# EAGLE design FARIOTSsch (EAGLE 9.6.2)
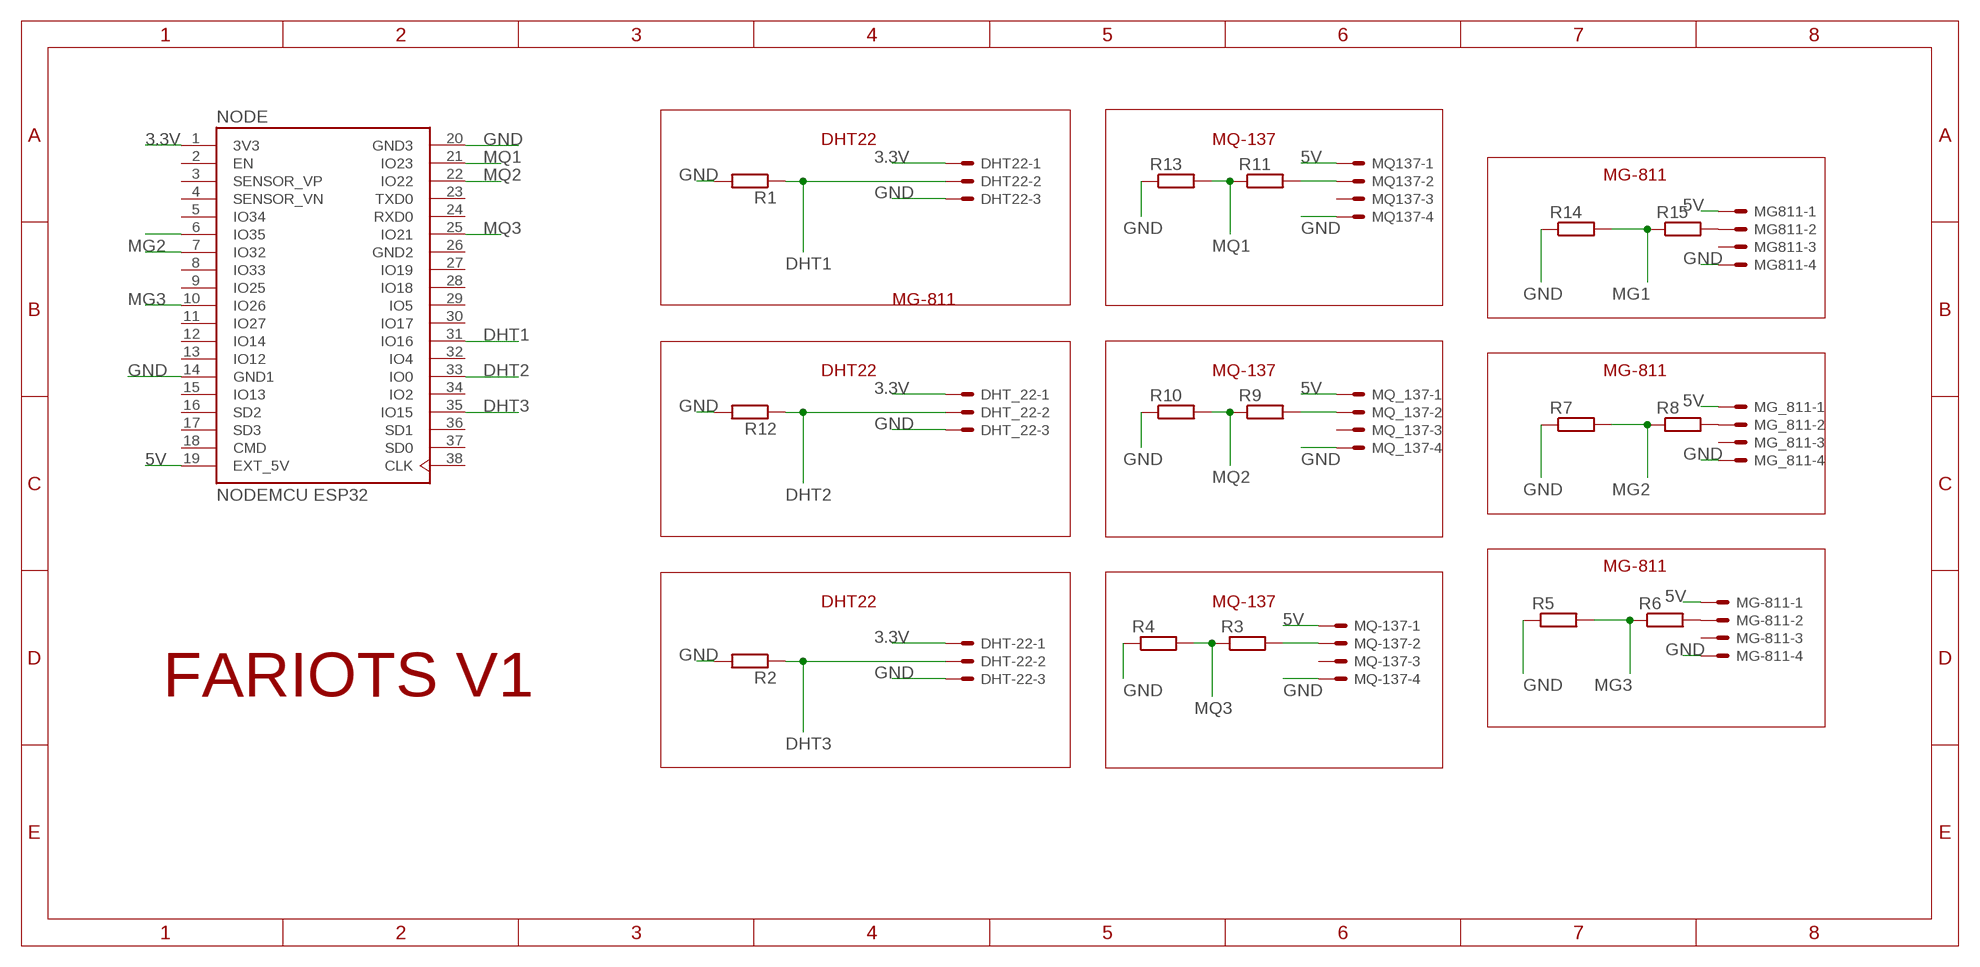
[diagram p0: schematic, sheet 1]

## Parts
DHT22  C-GRID-03-70543  [70543-03]
DHT-22  C-GRID-03-70543  [70543-03]
DHT_22  C-GRID-03-70543  [70543-03]
MG811  C-GRID-04-70543  [70543-04]
MG-811  C-GRID-04-70543  [70543-04]
MG_811  C-GRID-04-70543  [70543-04]
MQ137  C-GRID-04-70543  [70543-04]
MQ-137  C-GRID-04-70543  [70543-04]
MQ_137  C-GRID-04-70543  [70543-04]
NODE  NODEMCU ESP32  ESP32-DEVKITC-32D  [MODULE_ESP32-DEVKITC-32D]
R1  R-EU_0204/7  [0204/7]
R2  R-EU_0204/7  [0204/7]
R3  R-EU_0204/7  [0204/7]
R4  R-EU_0204/7  [0204/7]
R5  R-EU_0204/7  [0204/7]
R6  R-EU_0204/7  [0204/7]
R7  R-EU_0204/7  [0204/7]
R8  R-EU_0204/7  [0204/7]
R9  R-EU_0204/7  [0204/7]
R10  R-EU_0204/7  [0204/7]
R11  R-EU_0204/7  [0204/7]
R12  R-EU_0204/7  [0204/7]
R13  R-EU_0204/7  [0204/7]
R14  R-EU_0204/7  [0204/7]
R15  R-EU_0204/7  [0204/7]

## Nets
3.3V: DHT22.1 DHT-22.1 DHT_22.1 NODE.1(3V3)
5V: MG811.1 MG-811.1 MG_811.1 MQ137.1 MQ-137.1 MQ_137.1 NODE.19(EXT_5V)
DHT1: DHT22.2 NODE.31(IO16) R1.1
DHT2: DHT_22.2 NODE.33(IO0) R12.1
DHT3: DHT-22.2 NODE.35(IO15) R2.1
GND: DHT22.3 DHT-22.3 DHT_22.3 MG811.4 MG-811.4 MG_811.4 MQ137.4 MQ-137.4 MQ_137.4 NODE.14(GND1) NODE.20(GND3) R1.2 R2.2 R4.1 R5.1 R7.1 R10.1 R12.2 R13.1 R14.1
MG1: NODE.6(IO35) R14.2 R15.1
MG2: NODE.7(IO32) R7.2 R8.1
MG3: NODE.10(IO26) R5.2 R6.1
MQ1: NODE.21(IO23) R11.1 R13.2
MQ2: NODE.22(IO22) R9.1 R10.2
MQ3: NODE.25(IO21) R3.1 R4.2
N$1: MG-811.2 R6.2
N$2: MQ-137.2 R3.2
N$3: MG_811.2 R8.2
N$4: MQ_137.2 R9.2
N$5: MQ137.2 R11.2
N$6: MG811.2 R15.2
Unconnected: MG811.3 MG-811.3 MG_811.3 MQ137.3 MQ-137.3 MQ_137.3 NODE.2(EN) NODE.3(SENSOR_VP) NODE.4(SENSOR_VN) NODE.5(IO34) NODE.8(IO33) NODE.9(IO25) NODE.11(IO27) NODE.12(IO14) NODE.13(IO12) NODE.15(IO13) NODE.16(SD2) NODE.17(SD3) NODE.18(CMD) NODE.23(TXD0) NODE.24(RXD0) NODE.27(IO19) NODE.28(IO18) NODE.29(IO5) NODE.30(IO17) NODE.32(IO4) NODE.34(IO2) NODE.36(SD1) NODE.37(SD0) NODE.38(CLK)

## Notes on the sheet
- DHT22 | MQ-137
- MG-811
- MG-811
- DHT22 | MQ-137 | MG-811
- MG-811
- DHT22 | MQ-137
- FARIOTS V1

## Power pins joined to a net without a drawn wire
GND2: NODE.26(GND2)

## Library data of the parts
DHT22 DHT-22 DHT_22 = con-molex:C-GRID-03: CONNECTOR wire to board 2.54 mm (0.100") pitch header; MF: MOLEX; OC_FARNELL: unknown; OC_NEWARK: unknown
MG811 MG-811 MG_811 MQ137 MQ-137 MQ_137 = con-molex:C-GRID-04: CONNECTOR wire to board 2.54 mm (0.100") pitch header; MF: MOLEX; OC_FARNELL: unknown; OC_NEWARK: unknown
NODE = ESP32-DEVKITC-32D:ESP32-DEVKITC-32D: Eval Board For Esp-Wroom-32 Check availability <https://pricing.snapeda.com/parts/ESP32-DEVKITC-32D/Espressif%20Systems/view-part?ref=eda>; AVAILABILITY: In Stock; DESCRIPTION: WiFi Development Tools (802.11) ESP32 General Development Kit, ESP32-WROOM-32D on the board; MF: Espressif Systems; MP: ESP32-DEVKITC-32D; PACKAGE: None; PRICE: None; PURCHASE-URL: https://pricing.snapeda.com/search/part/ESP32-DEVKITC-32D/?ref=eda
R1-R15 = rcl:R-EU_: RESISTOR, European symbol; SPICEPREFIX: R

## Board
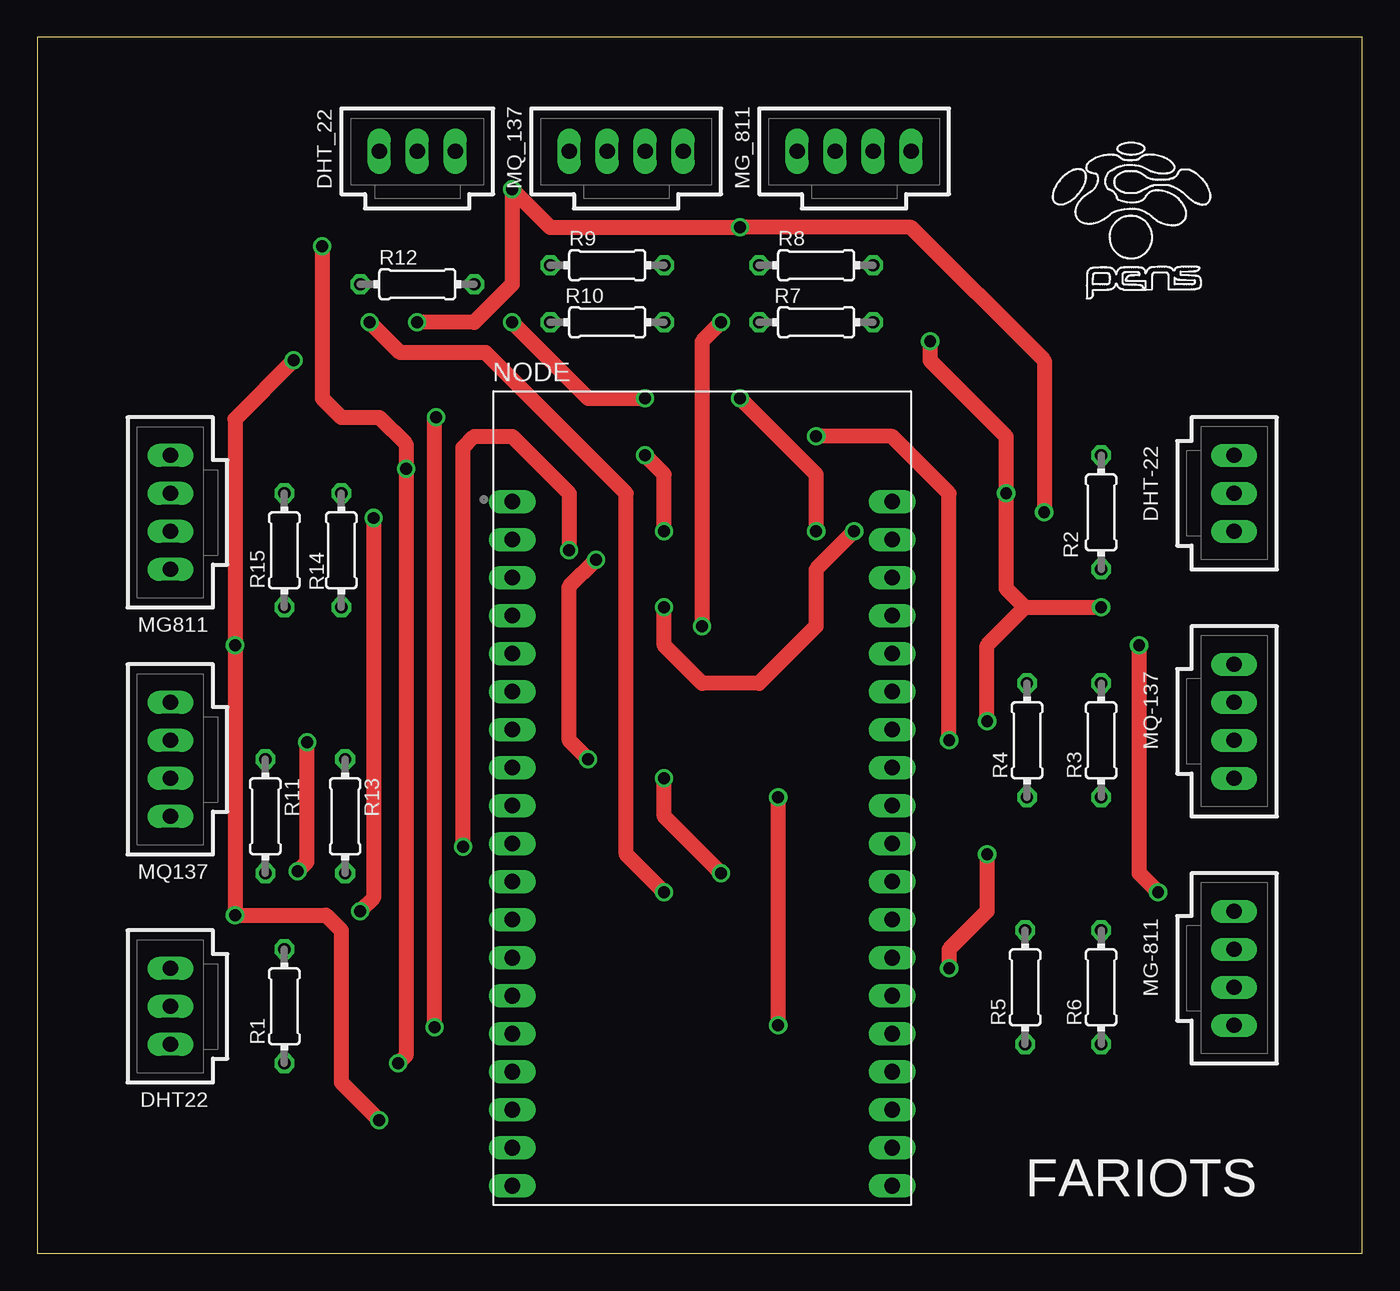
[diagram p1: board, top side]
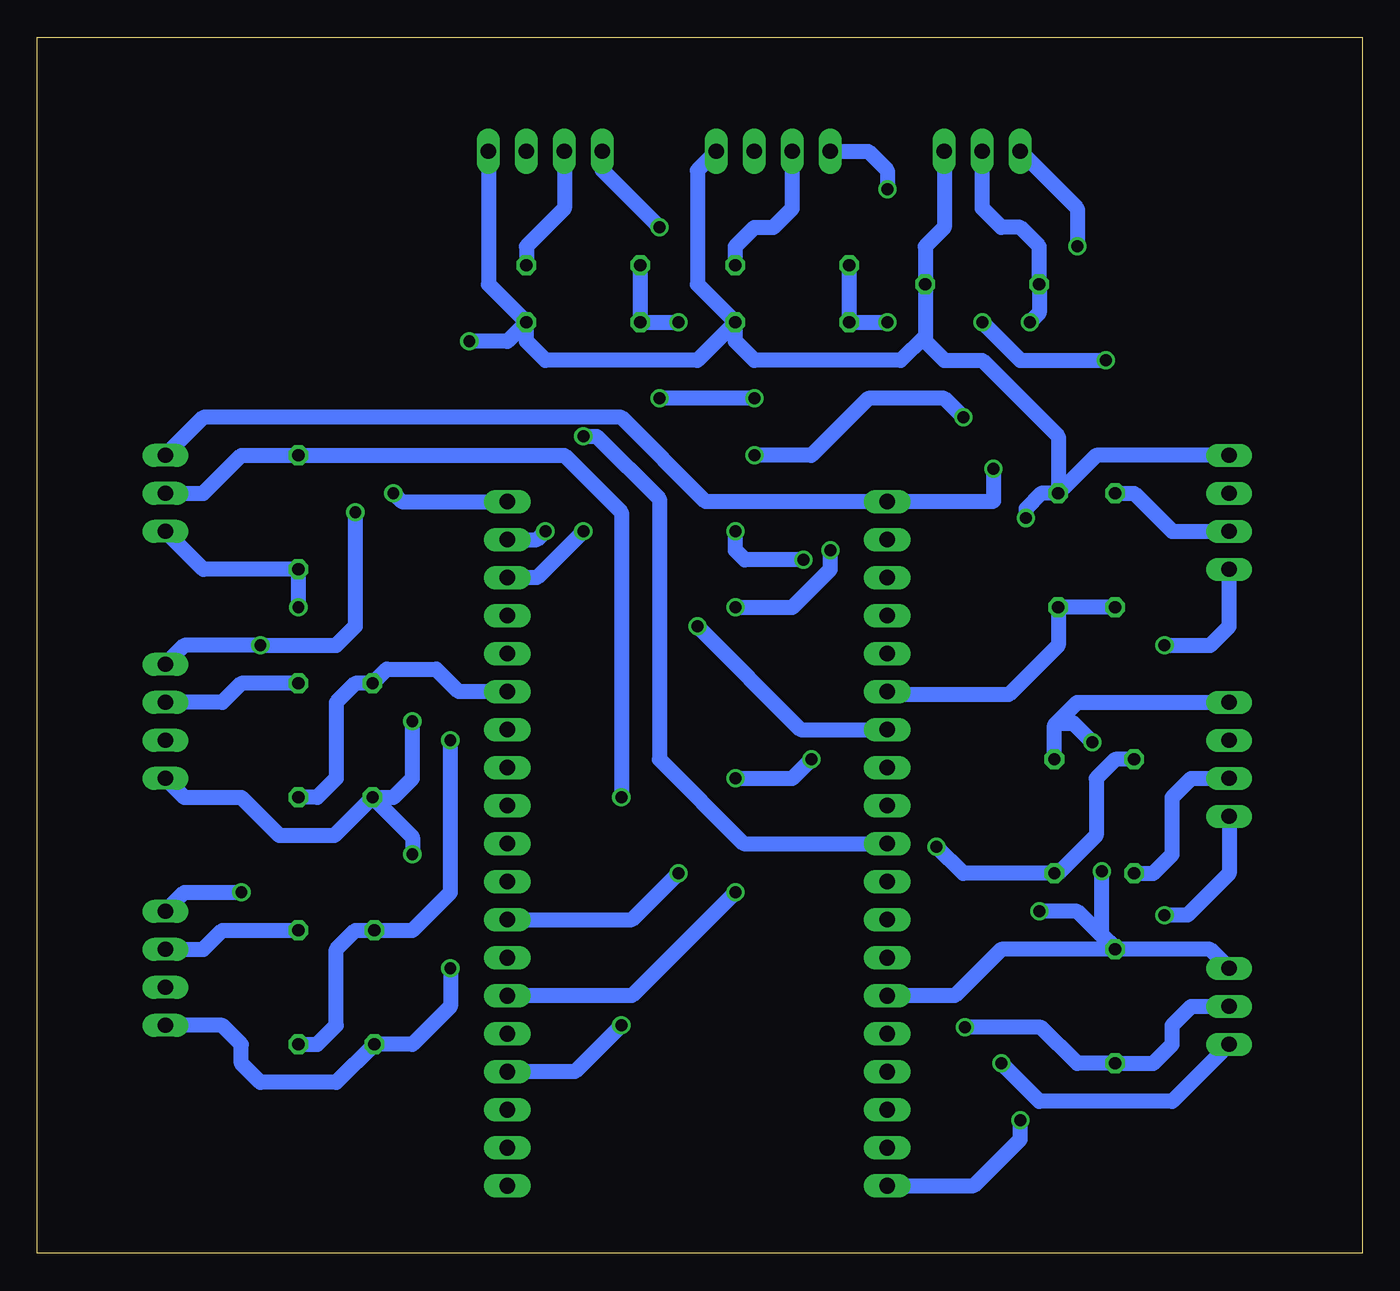
[diagram p2: board, bottom side, seen from below]

Size 88.57 x 81.27 mm. Coordinates in mm from the lower left corner, seen from the top.
Outline: 0,0 88.57,0 88.57,81.27 0,81.27 0,0
Copper layers (1*16): Top 0.035mm / dielectric 1.5mm / Bottom 0.035mm
Design rules "default *": minimum track width 6mil, minimum drill 0.35mm, track to track 6mil, track to pad 20mil, pad to pad 20mil, via to via 20mil, smd to smd 20mil, copper to edge 40mil, drill to drill 6mil, minimum pad ring 10mil, minimum via ring 8mil, stop-mask expansion 4mil, vias tented up to drill 0mil, thermal gap 10mil

### Footprints (pad centres in the part's own frame; a part is rotated, then mirrored left to right if it is on the bottom)
70543-03 = drill 1.016 long: 1 -2.54,0; 2 0,0; 3 2.54,0
70543-04 = drill 1.016 long: 1 -3.81,0; 2 -1.27,0; 3 1.27,0; 4 3.81,0
MODULE_ESP32-DEVKITC-32D = drill 1.04 long: 1 -12.7,19.76; 2 -12.7,17.22; 3 -12.7,14.68; 4 -12.7,12.14; 5 -12.7,9.6; 6 -12.7,7.06; 7 -12.7,4.52; 8 -12.7,1.98; 9 -12.7,-0.56; 10 -12.7,-3.1; 11 -12.7,-5.64; 12 -12.7,-8.18; 13 -12.7,-10.72; 14 -12.7,-13.26; 15 -12.7,-15.8; 16 -12.7,-18.34; 17 -12.7,-20.88; 18 -12.7,-23.42; 19 -12.7,-25.96; 20 12.7,19.76; 21 12.7,17.22; 22 12.7,14.68; 23 12.7,12.14; 24 12.7,9.6; 25 12.7,7.06; 26 12.7,4.52; 27 12.7,1.98; 28 12.7,-0.56; 29 12.7,-3.1; 30 12.7,-5.64; 31 12.7,-8.18; 32 12.7,-10.72; 33 12.7,-13.26; 34 12.7,-15.8; 35 12.7,-18.34; 36 12.7,-20.88; 37 12.7,-23.42; 38 12.7,-25.96
0204/7 = drill 0.813 octagon: 1 -3.81,0; 2 3.81,0

### Placement (x,y rotation side)
DHT22  8.89,16.51 90 top
DHT-22  80.01,50.8 270 top
DHT_22  25.4,73.66 0 top
MG811  8.89,49.53 90 top
MG-811  80.01,19.05 270 top
MG_811  54.61,73.66 0 top
MQ137  8.89,33.02 90 top
MQ-137  80.01,35.56 270 top
MQ_137  39.37,73.66 0 top
NODE  44.45,30.48 0 top
R1  16.51,16.51 90 top
R2  71.12,49.53 270 top
R3  71.12,34.29 90 top
R4  66.17,34.29 90 top
R5  66.04,17.78 90 top
R6  71.12,17.78 90 top
R7  52.07,62.23 180 top
R8  52.07,66.04 0 top
R9  38.1,66.04 0 top
R10  38.1,62.23 180 top
R11  15.24,29.21 270 top
R12  25.4,64.77 0 top
R13  20.57,29.21 270 top
R14  20.32,46.99 270 top
R15  16.51,46.99 90 top

### Tracks (layer width: path | path; a pad name or v marks a point on that pad's centre or on a via)
3.3V  (via drill 0.8)
  Top 1.016: v19.05,67.31 19.05,57.15 20.32,55.88 22.86,55.88 24.64,54.1 v24.64,52.45 24.64,13.21 v24.13,12.7
  Bottom 1.016: DHT22.1 12.7,10.16 21.59,10.16 v24.13,12.7 | v19.05,67.31 19.05,69.85 DHT_22.1 | DHT-22.1 77.47,55.88 49.53,55.88 43.89,50.24 NODE.1 24.69,50.24 24.64,50.29 v24.64,52.45
5V  (via drill 0.8)
  Top 1.016: v74.93,24.13 73.66,25.4 v73.66,40.64 | v22.86,8.89 20.32,11.43 20.32,21.59 19.3,22.61 v13.21,22.61 v13.21,40.64 13.21,55.75 v17.14,59.69 | v67.31,49.53 67.31,59.69 58.42,68.58 v46.99,68.58 34.29,68.58 v31.75,71.12 31.75,64.77 29.21,62.23 v25.4,62.23
  Bottom 1.016: MQ137.1 8.89,25.4 11.68,22.61 v13.21,22.61 | MG811.1 8.89,41.91 10.16,40.64 v13.21,40.64 | MQ_137.1 33.02,73.66 31.75,72.39 v31.75,71.12 | v46.99,68.58 50.8,72.39 MG_811.1 | MG-811.1 78.74,24.13 v74.93,24.13 | MQ-137.1 78.74,40.64 v73.66,40.64 68.58,40.64 67.31,41.91 v67.31,49.53 | NODE.19 25.96,4.52 22.86,7.62 v22.86,8.89 | v25.4,62.23 22.86,59.69 v17.14,59.69
DHT1  (via drill 0.8)
  Top 1.016: v26.54,15.11 26.54,55.75 v26.67,55.88 | v45.72,25.4 41.91,29.21 v41.91,31.75 | v36.83,33.02 35.56,34.29 35.56,44.58 v37.34,46.35 | v41.91,48.26 41.91,52.07 v40.64,53.34
  Bottom 1.016: DHT22.2 11.43,16.51 12.7,15.24 12.7,13.97 13.97,12.7 R1.1 19.05,12.7 21.46,15.11 v26.54,15.11 | v26.67,55.88 27.94,57.15 33.02,57.15 36.83,53.34 v40.64,53.34 | NODE.31 48.82,22.3 v45.72,25.4 | v41.91,31.75 38.1,31.75 v36.83,33.02 | v37.34,46.35 41.27,46.35 41.91,46.99 v41.91,48.26
DHT2  (via drill 0.8)
  Top 1.016: v22.23,62.23 24.26,60.2 29.97,60.2 39.37,50.8 39.37,26.67 v41.91,24.13
  Bottom 1.016: DHT_22.2 25.4,69.85 24.13,68.58 22.86,68.58 21.59,67.31 R12.1 21.59,62.87 v22.23,62.23 | v41.91,24.13 48.82,17.22 NODE.33
DHT3  (via drill 0.8)
  Top 1.016: v49.53,30.48 v49.53,15.24
  Bottom 1.016: DHT-22.2 77.47,50.8 74.93,53.34 R2.1 53.34,53.34 49.53,49.53 v49.53,30.48 | v49.53,15.24 52.63,12.14 NODE.35
GND  (via drill 0.8)
  Top 1.016: v59.69,60.96 59.69,59.69 64.77,54.61 v64.77,50.8 64.77,44.45 66.04,43.18 | v63.5,35.56 63.5,40.64 66.04,43.18 | 66.04,43.18 v71.12,43.18 | v17.4,25.53 18.03,26.16 v18.03,34.16 | v63.5,26.67 63.5,22.86 60.96,20.32 v60.96,19.05 | v22.48,49.15 22.48,23.75 v21.59,22.86
  Bottom 1.016: R14.1 17.78,53.34 MG811.4 | R12.2 29.21,60.96 27.94,59.69 25.4,59.69 20.32,54.61 R14.1 | DHT_22.3 27.94,68.58 29.21,67.31 R12.2 | R12.2 29.21,61.34 30.86,59.69 40.64,59.69 41.91,60.96 R10.1 | MQ_137.4 44.45,72.39 44.45,64.77 R10.1 | R10.1 44.45,59.69 54.61,59.69 55.88,60.96 R7.1 | R7.1 58.42,64.77 MG_811.4 | MG-811.4 76.2,15.24 74.93,13.97 74.93,12.7 73.66,11.43 68.58,11.43 R5.1 63.5,13.97 60.96,16.51 v60.96,19.05 | MQ-137.4 78.74,30.48 74.93,30.48 72.39,27.94 68.71,27.94 R4.1 | DHT-22.3 77.47,45.72 R2.2 v71.12,43.18 | R13.1 20.57,35.31 20.45,35.43 | 20.45,35.43 19.05,36.83 MQ137.4 | DHT22.3 10.16,20.32 R1.2 | R7.1 57.15,60.96 v59.69,60.96 | v64.77,50.8 64.21,50.24 NODE.20 | R4.1 64.77,30.48 63.5,31.75 v63.5,35.56 | R1.2 16.51,20.45 17.4,21.34 v17.4,25.53 | 20.45,35.43 19.3,35.43 v18.03,34.16 | R4.1 63.5,27.81 v63.5,26.67 | R1.2 24.13,20.32 27.23,17.22 NODE.14 | R1.2 19.05,22.86 v21.59,22.86 | R14.1 21.46,50.8 22.48,49.78 v22.48,49.15
MG1
  Bottom 1.016: R15.1 R14.2 20.32,40.64 23.62,37.34 26.54,37.34 31.55,37.34 NODE.6
MG2  (via drill 0.8)
  Top 1.016: v45.72,62.23 44.45,60.96 v44.45,41.91
  Bottom 1.016: R8.1 R7.2 v45.72,62.23 | NODE.7 37.54,35 v44.45,41.91
MG3  (via drill 0.8)
  Top 1.016: v60.96,34.29 60.96,50.8 57.15,54.61 v52.07,54.61
  Bottom 1.016: R6.1 69.85,13.97 68.58,15.24 68.58,20.32 67.31,21.59 R5.2 63.5,21.59 60.96,24.13 v60.96,34.29 | v52.07,54.61 51.18,54.61 46.99,50.42 46.99,33.02 41.35,27.38 NODE.10
MQ1  (via drill 0.8)
  Top 1.016: v35.56,46.99 35.56,50.8 31.75,54.61 29.21,54.61 28.45,53.85 v28.45,27.18 | v54.61,48.26 52.07,45.72 52.07,41.91 48.26,38.1 44.45,38.1 41.91,40.64 v41.91,43.18
  Bottom 1.016: v28.45,27.18 26.67,25.4 R13.2 20.32,25.4 17.78,27.94 17.78,31.75 16.51,33.02 R11.1 | NODE.21 55.17,47.7 v54.61,48.26 | v41.91,43.18 38.1,43.18 35.56,45.72 v35.56,46.99
MQ2  (via drill 0.8)
  Top 1.016: v31.75,62.23 36.83,57.15 v40.64,57.15 | v46.99,57.15 52.07,52.07 v52.07,48.26
  Bottom 1.016: R9.1 R10.2 v31.75,62.23 | v52.07,48.26 55.17,45.16 NODE.22 | v40.64,57.15 v46.99,57.15
MQ3
  Bottom 1.016: R3.1 69.85,30.48 68.58,31.75 68.58,36.83 67.31,38.1 R4.2 65.21,39.05 61.91,39.05 60.4,37.54 NODE.25
N$1
  Bottom 1.016: MG-811.2 77.47,20.32 76.2,21.59 R6.2
N$2
  Bottom 1.016: R3.2 74.93,38.1 76.2,36.83 MQ-137.2
N$3
  Bottom 1.016: MG_811.2 53.34,69.85 55.88,67.31 R8.2
N$4
  Bottom 1.016: R9.2 41.91,67.31 40.64,68.58 39.37,68.58 38.1,69.85 MQ_137.2
N$5
  Bottom 1.016: R11.2 13.97,25.4 12.7,26.67 12.7,30.48 11.43,31.75 MQ137.2
N$6
  Bottom 1.016: R15.2 15.24,50.8 12.7,48.26 MG811.2

### Text on the board
tNames: FARIOTS